# EAGLE design SSRBoard (EAGLE 6.3)
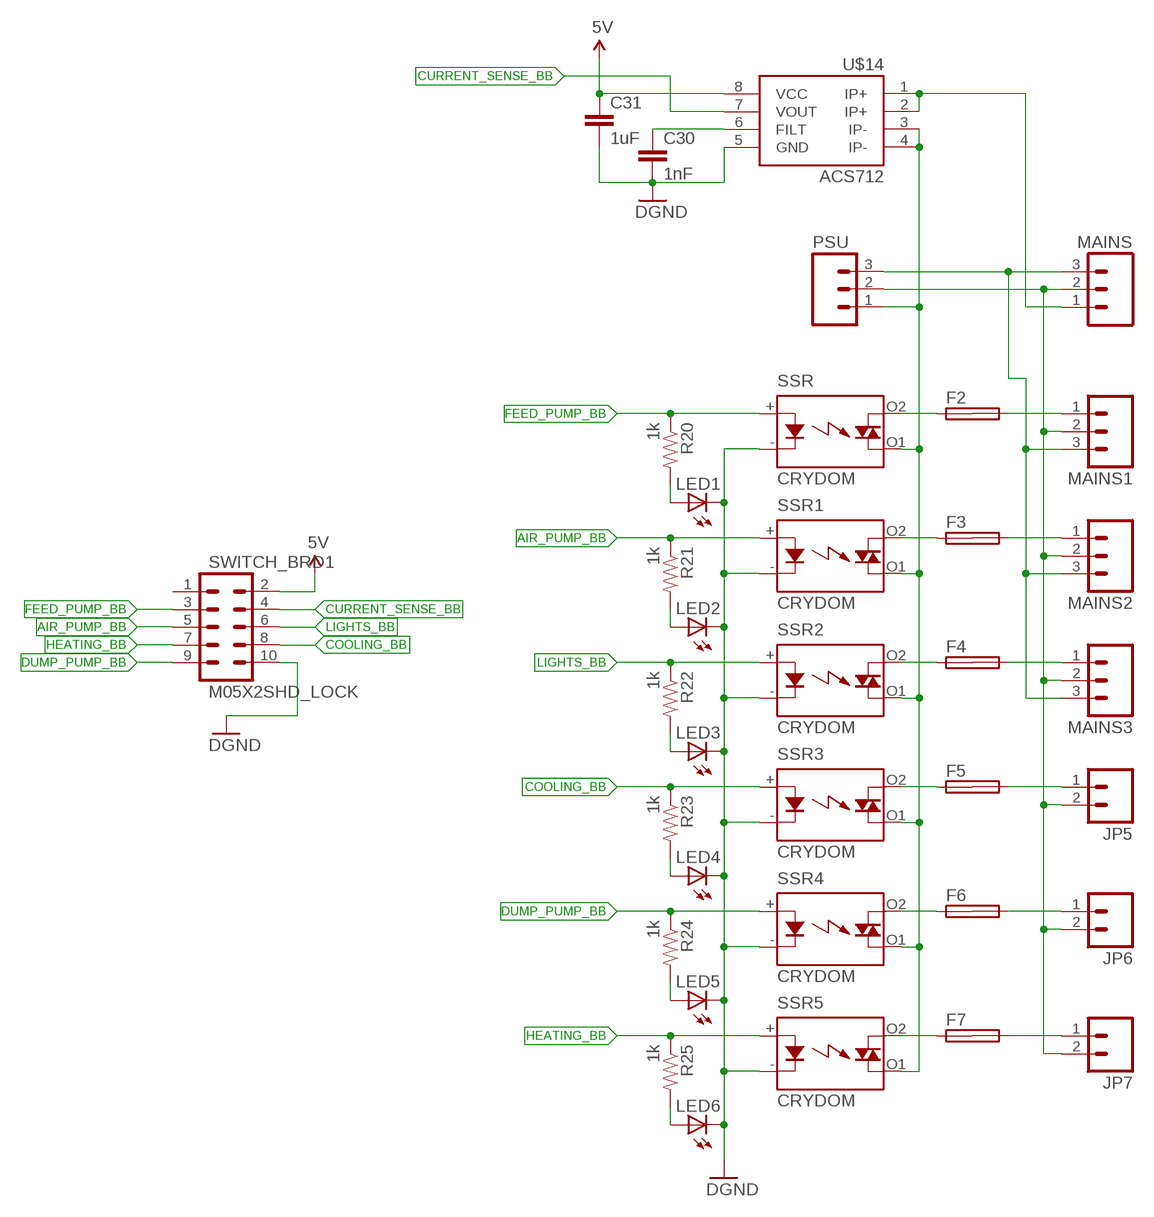
[diagram p0: schematic, sheet 1]

## Parts
C30  1nF  CAP0805  [0805]
C31  1uF  CAP0805  [0805]
F2  SHK20L  [SHK20L]
F3  SHK20L  [SHK20L]
F4  SHK20L  [SHK20L]
F5  SHK20L  [SHK20L]
F6  SHK20L  [SHK20L]
F7  SHK20L  [SHK20L]
JP5  M025MM  [SCREWTERMINAL-5MM-2]
JP6  M025MM  [SCREWTERMINAL-5MM-2]
JP7  M025MM  [SCREWTERMINAL-5MM-2]
LED1  LEDSML0805  [SML0805]
LED2  LEDSML0805  [SML0805]
LED3  LEDSML0805  [SML0805]
LED4  LEDSML0805  [SML0805]
LED5  LEDSML0805  [SML0805]
LED6  LEDSML0805  [SML0805]
MAINS  M03-SCREW-5MM  [SCREWTERMINAL-5MM-3]
MAINS1  M03-SCREW-5MM  [SCREWTERMINAL-5MM-3]
MAINS2  M03-SCREW-5MM  [SCREWTERMINAL-5MM-3]
MAINS3  M03-SCREW-5MM  [SCREWTERMINAL-5MM-3]
PSU  M03-SCREW-5MM  [SCREWTERMINAL-5MM-3]
R20  1k  RESISTOR0805-RES  [0805]
R21  1k  RESISTOR0805-RES  [0805]
R22  1k  RESISTOR0805-RES  [0805]
R23  1k  RESISTOR0805-RES  [0805]
R24  1k  RESISTOR0805-RES  [0805]
R25  1k  RESISTOR0805-RES  [0805]
SSR  CRYDOM  AQG22224  [AQG]
SSR1  CRYDOM  AQG22224  [AQG]
SSR2  CRYDOM  AQG22224  [AQG]
SSR3  CRYDOM  AQG22224  [AQG]
SSR4  CRYDOM  AQG22224  [AQG]
SSR5  CRYDOM  AQG22224  [AQG]
SWITCH_BRD1  M05X2SHD_LOCK  [2X5-SHROUDED_LOCK]
U$14  ACS712  [SO08]

## Nets
5V_BB: C31.1 SWITCH_BRD1.2 U$14.8(VCC) ; supply symbol labelled 5V
AIR_PUMP_BB: R21.1 SSR1.+(A) SWITCH_BRD1.5
COOLING_BB: R23.1 SSR3.+(A) SWITCH_BRD1.8
CURRENT_SENSE_BB: SWITCH_BRD1.4 U$14.7(VOUT)
DUMP_PUMP_BB: R24.1 SSR4.+(A) SWITCH_BRD1.9
FEED_PUMP_BB: R20.1 SSR.+(A) SWITCH_BRD1.3
GND_BB: C30.2 C31.2 LED1.C LED2.C LED3.C LED4.C LED5.C LED6.C SSR1.-(K) SSR2.-(K) SSR3.-(K) SSR4.-(K) SSR5.-(K) SSR.-(K) SWITCH_BRD1.10 U$14.5(GND) ; supply symbol labelled DGND
HEATING_BB: R25.1 SSR5.+(A) SWITCH_BRD1.7
LIGHTS_BB: R22.1 SSR2.+(A) SWITCH_BRD1.6
MAIN_ACTIVE: PSU.1 SSR1.O1(DS2) SSR2.O1(DS2) SSR3.O1(DS2) SSR4.O1(DS2) SSR5.O1(DS2) SSR.O1(DS2) U$14.3(IP-) U$14.4(IP-)
MAIN_ACTIVE1: MAINS.1 U$14.1(IP+) U$14.2(IP+)
MAIN_EARTH: MAINS1.3 MAINS2.3 MAINS3.3 MAINS.3 PSU.3
MAIN_NETURAL: JP5.2 JP6.2 JP7.2 MAINS1.2 MAINS2.2 MAINS3.2 MAINS.2 PSU.2
N$37: F3.1A SSR1.O2(DS1)
N$38: F2.1A SSR.O2(DS1)
N$39: F4.1A SSR2.O2(DS1)
N$40: F5.1A SSR3.O2(DS1)
N$41: F6.1A SSR4.O2(DS1)
N$42: F7.1A SSR5.O2(DS1)
N$43: LED1.A R20.2
N$44: F2.2A MAINS1.1
N$45: F3.2A MAINS2.1
N$46: F4.2A MAINS3.1
N$47: F5.2A JP5.1
N$48: F6.2A JP6.1
N$49: F7.2A JP7.1
N$50: LED2.A R21.2
N$51: LED3.A R22.2
N$52: LED4.A R23.2
N$53: C30.1 U$14.6(FILT)
N$59: LED5.A R24.2
N$60: LED6.A R25.2
Unconnected: F2.1B F2.2B F3.1B F3.2B F4.1B F4.2B F5.1B F5.2B F6.1B F6.2B F7.1B F7.2B SWITCH_BRD1.1

## Library data of the parts
C30 C31 = SparkFun-Capacitors:CAP: Capacitor Standard 0603 ceramic capacitor, and 0.1" leaded capacitor.
F2-F7 = fuse:SHK20L: FUSE HOLDER 5 x 20 mm, SH contact, SHH1 Schukat, E1073 Buerklin; OC_FARNELL: unknown; OC_NEWARK: unknown
JP5-JP7 = SparkFun-Connectors:M02: Header 2 Standard 2-pin 0.1" header. Use with straight break away headers (SKU : PRT-00116), right angle break away headers (PRT-00553), swiss pins (PRT-00743), machine pins (PRT-00117), and female headers (PRT-00115). Molex polarized connector foot print use with SKU : PRT-08233 with associated crimp pins and housings.
LED1-LED6 = led:LED: LED OSRAM: - CHIPLED LG R971, LG N971, LY N971, LG Q971, LY Q971, LO R971, LY R971 LH N974, LH R974 LS Q976, LO Q976, LY Q976 LO Q996 - Hyper CHIPLED LW Q18S LB Q993, LB Q99A, LB R99A - SideLED LS A670, LO A670, LY A670, LG A670, LP A670 LB A673, LV A673, LT A673, LW A673 LH A674 LY A675 LS A676, LA A676, LO A676, LY A676, LW A676 LS A679, LY A679, LG A679 - Hyper Micro SIDELED® LS Y876, LA Y876, LO Y876, LY Y876 LT Y87S - SmartLED LW L88C, LW L88S LB L89C, LB L89S, LG L890 LS L89K, LO L89K, LY L89K LS L896, LA L896, LO L896, LY L896 - TOPLED LS T670, LO T670, LY T670, LG T670, LP T670 LSG T670, LSP T670, LSY T670, LOP T670, LYG T670 LG T671, LOG T671, LSG T671 LB T673, LV T673, LT T673, LW T673 LH T674 LS T676, LA T676, LO T676, LY T676, LB T676, LH T676, LSB T676, LW T676 LB T67C, LV T67C, LT T67C, LS T67K, LO T67K, LY T67K, LW E67C LS E67B, LA E67B, LO E67B, LY E67B, LB E67C, LV E67C, LT E67C LW T67C LS T679, LY T679, LG T679 LS T770, LO T770, LY T770, LG T770, LP T770 LB T773, LV T773, LT T773, LW T773 LH T774 LS E675, LA E675, LY E675, LS T675 LS T776, LA T776, LO T776, LY T776, LB T776 LHGB T686 LT T68C, LB T68C - Hyper Mini TOPLED® LB M676 - Mini TOPLED Santana® LG M470 LS M47K, LO M47K, LY M47K Source: http://www.osram.convergy.de LUXEON: - LUMILED® LXK2-PW12-R00, LXK2-PW12-S00, LXK2-PW14-U00, LXK2-PW14-V00 LXK2-PM12-R00, LXK2-PM12-S00, LXK2-PM14-U00 LXK2-PE12-Q00, LXK2-PE12-R00, LXK2-PE12-S00, LXK2-PE14-T00, LXK2-PE14-U00 LXK2-PB12-K00, LXK2-PB12-L00, LXK2-PB12-M00, LXK2-PB14-N00, LXK2-PB14-P00, LXK2-PB14-Q00 LXK2-PR12-L00, LXK2-PR12-M00, LXK2-PR14-Q00, LXK2-PR14-R00 LXK2-PD12-Q00, LXK2-PD12-R00, LXK2-PD12-S00 LXK2-PH12-R00, LXK2-PH12-S00 LXK2-PL12-P00, LXK2-PL12-Q00, LXK2-PL12-R00 Source: www.luxeon.com KINGBRIGHT: KA-3528ASYC Source: www.kingbright.com
MAINS MAINS1-MAINS3 PSU = SparkFun-Connectors:M03: Header 3 Standard 3-pin 0.1" header. Use with straight break away headers (SKU : PRT-00116), right angle break away headers (PRT-00553), swiss pins (PRT-00743), machine pins (PRT-00117), and female headers (PRT-00115). Molex polarized connector foot print use with SKU : PRT-08232 with associated crimp pins and housings.
R20-R25 = SparkFun-Resistors:RESISTOR: Resistor Basic schematic elements and footprints for 0603, 1206, and PTH resistors.
SSR SSR1-SSR5 = 1_Skips:AQG*: SOLID STATE RELAY NAiS Zero-cross, Non zero-cross Source: http://www.mew-europe.com/.. en_ds_61611_0000.pdf; MPN: AQG22224; OC_FARNELL: unknown; OC_NEWARK: 11N2589
SWITCH_BRD1 = SparkFun-Connectors:M05X2: Header 5x2 Standard 10-pin dual row 0.1" header. Commonly used with AVR-ISP. Use with Spark Fun Electronics SKU: PRT-00778
U$14 = SparkFun-AnalogIC:ACS712: Hall-effect-based isolated linear current sensor

## Board
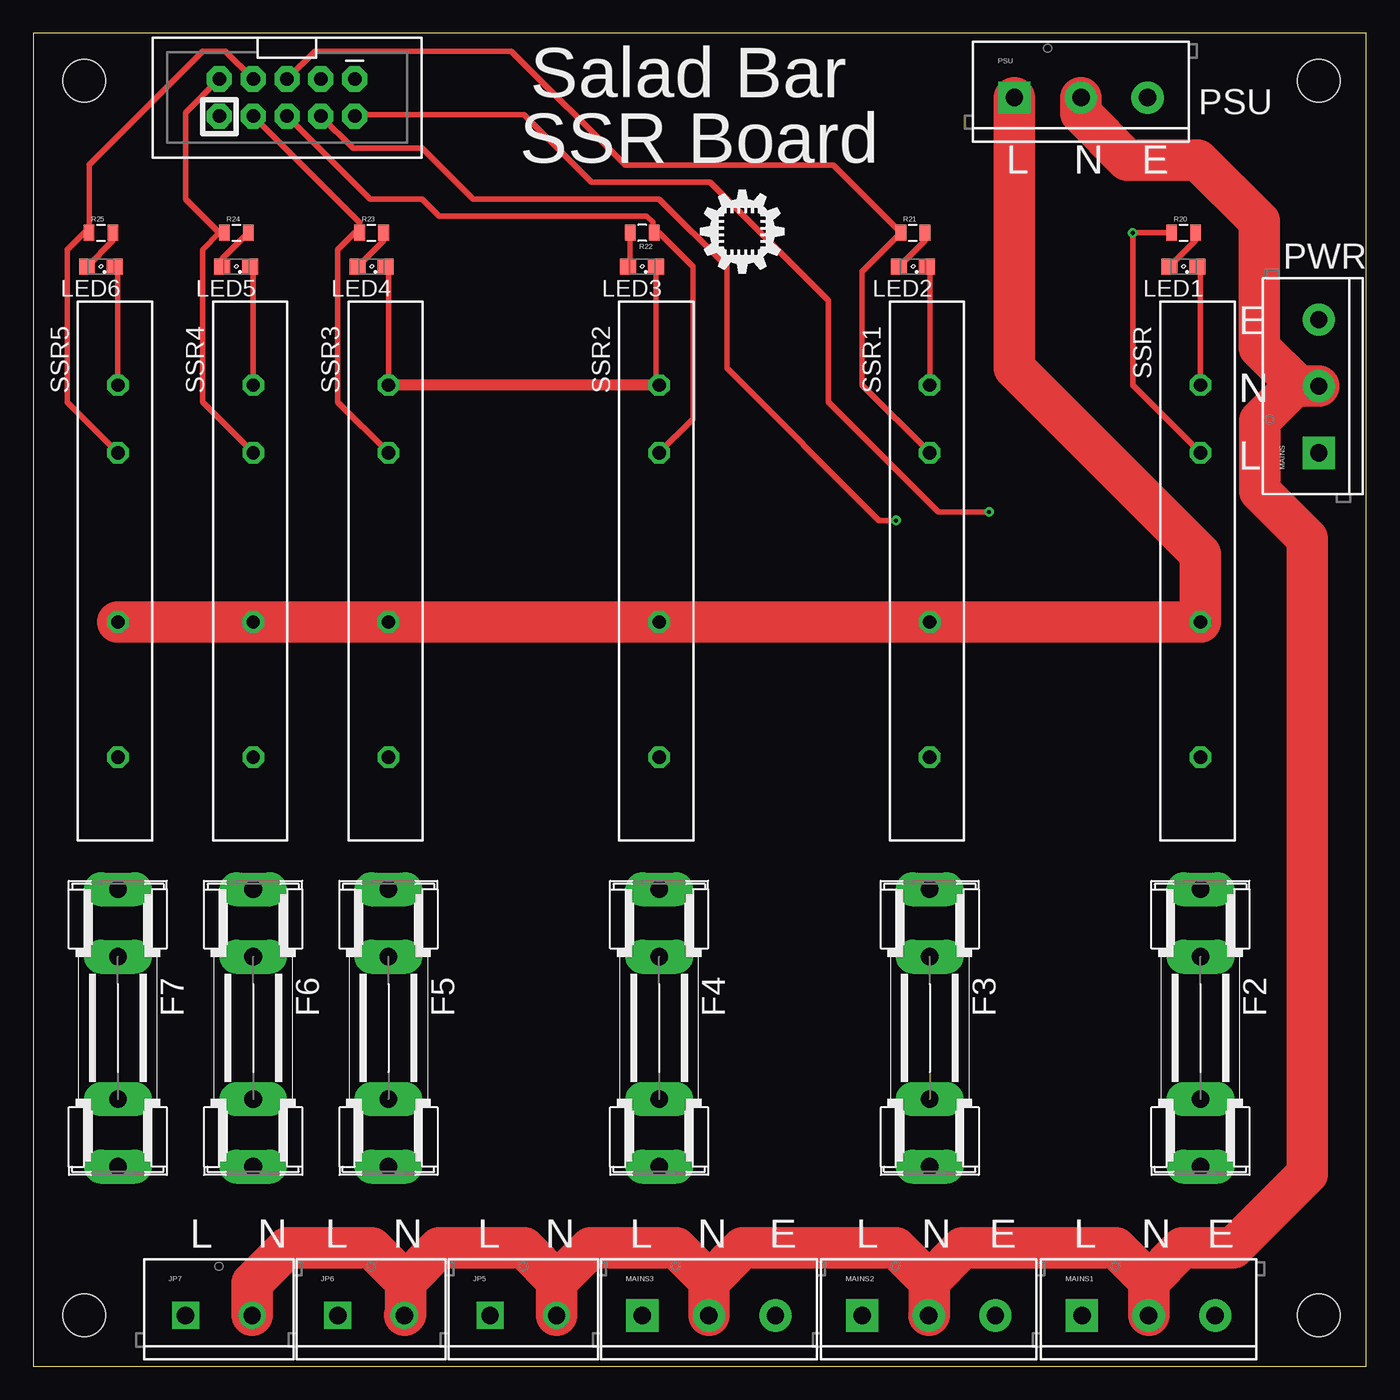
[diagram p1: board, top side]
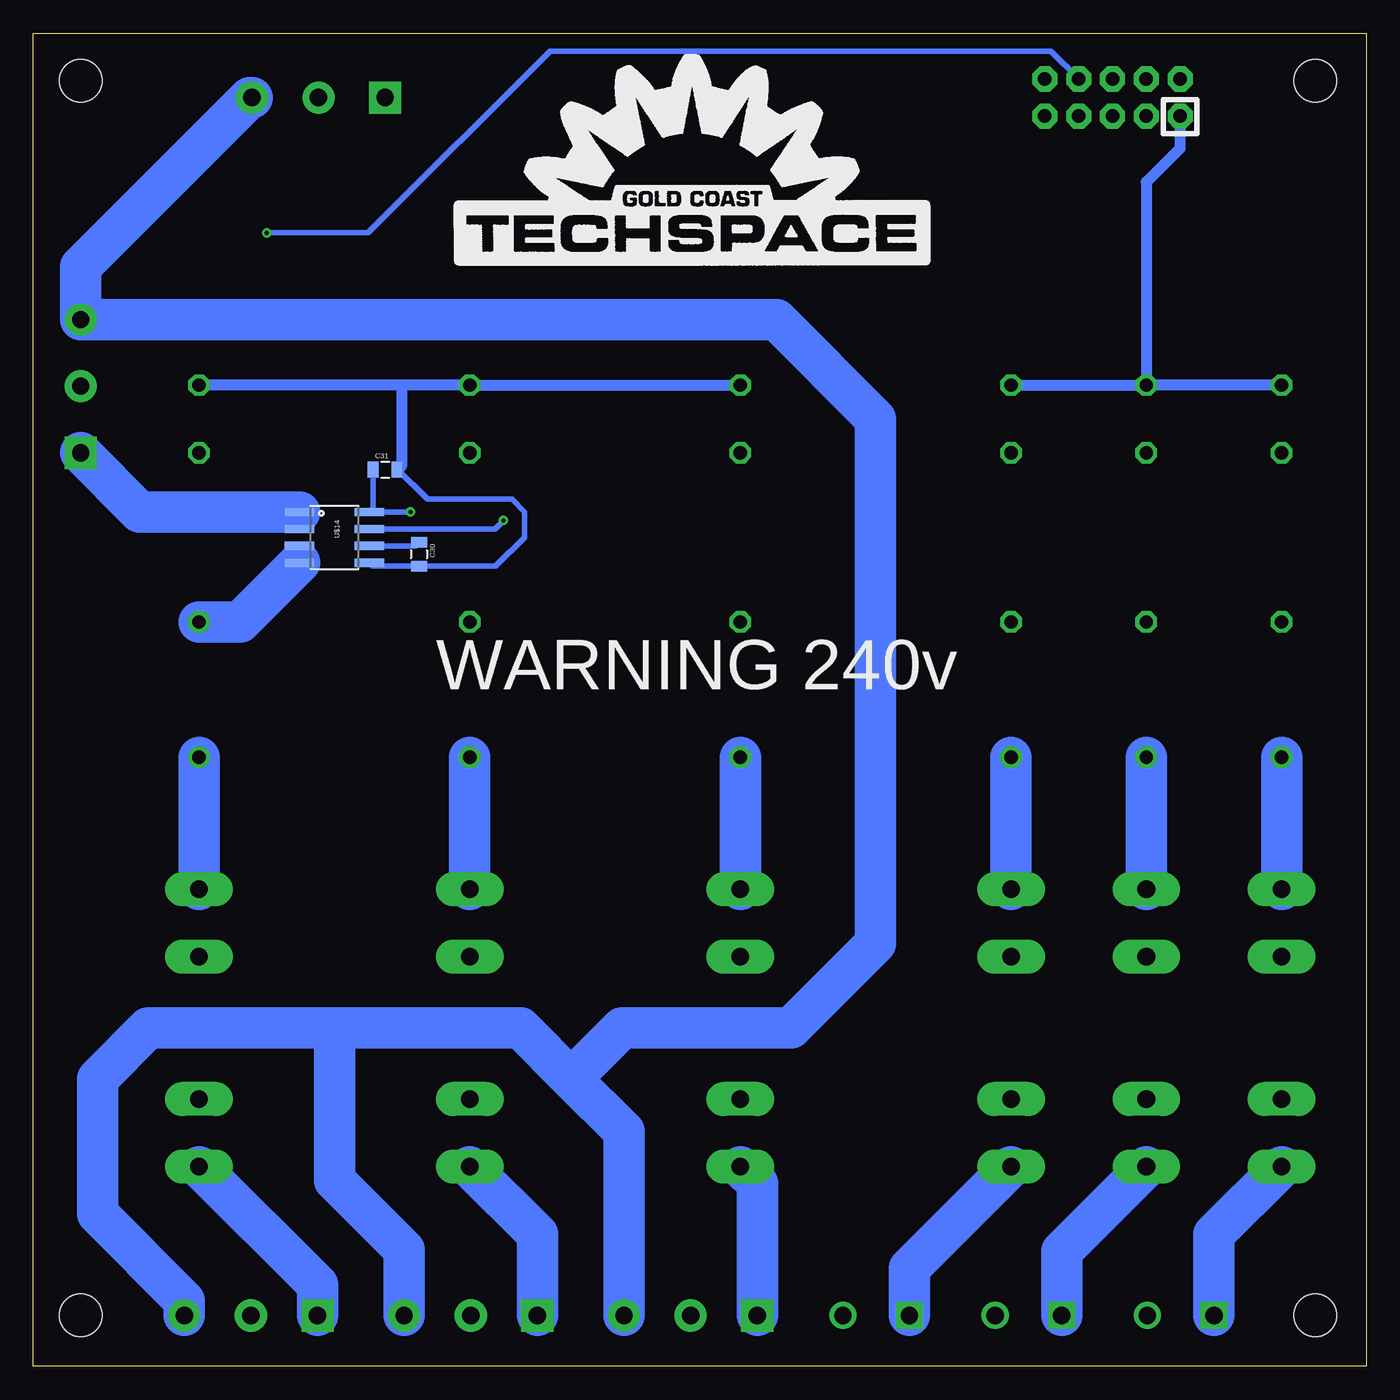
[diagram p2: board, bottom side, seen from below]

Size 100.08 x 100.08 mm. Coordinates in mm from the lower left corner, seen from the top.
Outline: 0,0 100.08,0 100.08,100.08 0,100.08 0,0
Copper layers (1*16): Top 0.035mm / dielectric 1.5mm / Bottom 0.035mm
Design rules "DFRobot_Eagle_Rule_v0.4": minimum track width 6mil, minimum drill 12mil, track to track 6mil, track to pad 6mil, pad to pad 6mil, via to via 6mil, smd to smd 0mil, copper to edge 10mil, drill to drill 10mil, minimum pad ring 12mil, minimum via ring 8mil, stop-mask expansion 2mil, vias tented up to drill 25mil, thermal gap 10mil
Holes 3.2 mm at 3.81,96.52 96.52,96.52 96.52,3.81 3.81,3.81

### Footprints (pad centres in the part's own frame; a part is rotated, then mirrored left to right if it is on the bottom)
0805 = smd 0.8 x 1.2: 1 -0.9,0; 2 0.9,0
SHK20L = drill 1.321 pad 2.54 long: 1A -10.414,0; 1B -5.334,0; 2A 10.414,0; 2B 5.334,0
SCREWTERMINAL-5MM-2 = drill 1.3 pad 2.032 square: 1 0,0 | drill 1.3 pad 2.032: 2 5,0
SML0805 = smd 1.2 x 1.2: A 1.05,0; C -1.05,0
SCREWTERMINAL-5MM-3 = drill 1.3 pad 2.413 square: 1 0,0 | drill 1.3 pad 2.413: 2 5,0; 3 10,0
AQG = drill 1 octagon: + 5.08,0; - 0,0; O1 17.78,0; O2 27.94,0
2X5-SHROUDED_LOCK = drill 1.016 pad 1.88 octagon: 1 -1.397,5.08; 2 1.397,5.08; 3 -1.397,2.54; 4 1.397,2.54; 5 -1.397,0; 6 1.397,0; 7 -1.397,-2.54; 8 1.397,-2.54; 9 -1.397,-5.08; 10 1.397,-5.08
SO08 = smd 0.61 x 2.21: 1 -1.905,-2.616; 2 -0.635,-2.616; 3 0.635,-2.616; 4 1.905,-2.616; 5 1.905,2.616; 6 0.635,2.616; 7 -0.635,2.616; 8 -1.905,2.616

### Placement (x,y rotation side)
C30  71.12,60.96 270 bottom
C31  73.66,67.31 0 bottom
F2  87.63,25.4 270 top
F3  67.31,25.4 270 top
F4  46.99,25.4 270 top
F5  26.67,25.4 270 top
F6  16.51,25.4 270 top
F7  6.35,25.4 270 top
JP5  34.29,3.81 0 top
JP6  22.86,3.81 0 top
JP7  11.43,3.81 0 top
LED1  86.36,82.55 180 top
LED2  66.04,82.55 180 top
LED3  45.72,82.55 180 top
LED4  25.4,82.55 180 top
LED5  15.24,82.55 180 top
LED6  5.08,82.55 180 top
MAINS  96.52,68.58 90 top
MAINS1  78.74,3.81 0 top
MAINS2  62.23,3.81 0 top
MAINS3  45.72,3.81 0 top
PSU  73.66,95.25 0 top
R20  86.36,85.09 0 top
R21  66.04,85.09 0 top
R22  45.72,85.09 180 top
R23  25.4,85.09 0 top
R24  15.24,85.09 0 top
R25  5.08,85.09 0 top
SSR  87.63,73.66 270 top
SSR1  67.31,73.66 270 top
SSR2  46.99,73.66 270 top
SSR3  26.67,73.66 270 top
SSR4  16.51,73.66 270 top
SSR5  6.35,73.66 270 top
SWITCH_BRD1  19.05,95.25 270 top
U$14  77.47,62.23 270 bottom
U$21  [GCTS_X0.75]  68.58,82.55 0 bottom
U$24  [ID_LOGO_X0.25]  50.01,81.92 0 top

### Tracks (layer width: path | path; a pad name or v marks a point on that pad's centre or on a via)
5V_BB  (via drill 0.3)
  Top 0.406: SWITCH_BRD1.2 24.26,93.98 36.83,93.98 41.91,88.9 50.8,88.9 59.69,80.01 59.69,72.39 67.94,64.14 v71.75,64.14
  Bottom 0.406: C31.1 74.56,64.43 U$14.8 v71.75,64.14
AIR_PUMP_BB
  Top 0.406: SWITCH_BRD1.5 21.14,98.74 35.88,98.74 44.45,90.17 60.06,90.17 R21.1 62.23,82.18 62.23,73.66 SSR1.+
COOLING_BB
  Top 0.406: SSR3.+ 22.86,72.39 22.86,83.82 24.13,85.09 R23.1 24.5,85.86 SWITCH_BRD1.8
CURRENT_SENSE_BB  (via drill 0.3)
  Top 0.406: v64.77,63.5 63.5,63.5 52.07,74.93 52.07,82.55 46.99,87.63 33.02,87.63 29.21,91.44 24,91.44 SWITCH_BRD1.4
  Bottom 0.406: U$14.7 65.41,62.87 v64.77,63.5
DUMP_PUMP_BB
  Top 0.406: 13.97,85.09 12.7,83.82 12.7,72.39 SSR4.+ | SWITCH_BRD1.9 11.43,94.11 11.43,87.63 13.97,85.09 | 13.97,85.09 R24.1
FEED_PUMP_BB  (via drill 0.3)
  Top 0.406: R20.1 v82.55,85.09 82.55,73.66 SSR.+
  Bottom 0.406: SWITCH_BRD1.3 23.69,98.74 61.28,98.74 74.93,85.09 v82.55,85.09
GND_BB
  Top 0.406: LED1.C 87.63,82.33 SSR.- | SSR1.- 67.31,82.33 LED2.C 67.31,82.55 | 46.99,82.33 LED3.C 46.77,73.88 SSR2.- | LED4.C 26.67,82.33 SSR3.- | LED5.C 16.51,82.33 SSR4.- | LED6.C 6.35,82.33 SSR5.-
  Top 0.813: SSR2.- SSR3.-
  Bottom 0.406: U$14.5 74.59,60.06 C30.2 65.35,60.06 63.18,62.23 63.18,64.14 64.14,65.09 70.48,65.09 72.71,67.31 C31.2
  Bottom 0.813: SSR4.- 16.51,88.9 13.97,91.44 SWITCH_BRD1.10 | SSR5.- SSR4.- | SSR3.- SSR4.- | SSR2.- SSR1.- 72.39,73.66 | 72.39,73.66 SSR.- | 72.71,67.31 72.39,67.63 72.39,73.66
HEATING_BB
  Top 0.406: SSR5.+ 2.54,72.39 2.54,83.82 3.81,85.09 R25.1 4.18,90.22 12.7,98.74 14.41,98.74 SWITCH_BRD1.7
LIGHTS_BB
  Top 0.406: SWITCH_BRD1.6 25.27,87.63 29.21,87.63 30.48,86.36 46.04,86.36 46.51,85.88 46.51,85.2 R22.1 46.99,85.09 49.53,82.55 49.53,71.12 SSR2.+
MAIN_ACTIVE
  Top 3.1: SSR5.O1 SSR4.O1 SSR3.O1 SSR2.O1 SSR1.O1 SSR.O1 87.63,60.96 73.66,74.93 PSU.1
  Bottom 0.406: U$14.3 U$14.4
  Bottom 3.1: U$14.4 84.53,55.88 SSR.O1
MAIN_ACTIVE1
  Bottom 0.406: U$14.2 U$14.1
  Bottom 3.1: MAINS.1 92.08,64.14 U$14.1
MAIN_EARTH
  Bottom 3.1: PSU.3 83.82,95.25 96.52,82.55 MAINS.3 44.29,78.58 36.83,71.12 36.83,31.75 43.18,25.4 55.88,25.4 59.69,21.59 | MAINS3.3 55.72,17.62 59.69,21.59 | 59.69,21.59 63.5,25.4 77.47,25.4 | MAINS2.3 72.23,8.73 77.47,13.97 77.47,25.4 | MAINS1.3 88.74,4.92 95.25,11.43 95.25,21.59 91.44,25.4 77.47,25.4
MAIN_NETURAL
  Top 3.1: MAINS.2 94.96,73.58 | 94.96,73.58 92.06,76.48 92.06,85.96 87.45,90.56 82.16,90.56 78.66,94.06 PSU.2 | JP7.2 16.43,6.27 19.05,8.89 25.4,8.89 27.94,6.35 | 27.94,6.35 27.94,3.89 JP6.2 | JP5.2 39.29,6.35 | 39.29,6.35 39.29,6.43 36.83,8.89 30.48,8.89 27.94,6.35 | 50.72,6.35 50.72,6.43 48.26,8.89 41.83,8.89 39.29,6.35 | 67.27,6.39 69.77,8.89 81.28,8.89 83.74,6.43 83.74,6.35 | 67.27,6.39 67.23,6.35 67.23,6.43 64.77,8.89 53.26,8.89 50.72,6.35 | 94.96,73.58 94.67,73.58 92.09,71 92.09,65.72 95.65,62.16 95.65,14.45 90.09,8.89 86.28,8.89 83.74,6.35 | 50.72,6.35 MAINS3.2 | 83.74,5 MAINS1.2 83.74,6.35 | MAINS2.2 67.27,3.85 67.27,6.39
N$37
  Bottom 3.1: SSR1.O2 F3.1A
N$38
  Bottom 3.1: SSR.O2 F2.1A
N$39
  Bottom 3.1: SSR2.O2 F4.1A
N$40
  Bottom 3.1: SSR3.O2 F5.1A
N$41
  Bottom 3.1: SSR4.O2 F6.1A
N$42
  Bottom 3.1: SSR5.O2 F7.1A
N$43
  Top 0.406: LED1.A 87.26,84.5 R20.2
N$44
  Bottom 3.1: F2.2A 78.74,6.1 MAINS1.1
N$45
  Bottom 3.1: F3.2A 62.23,9.91 MAINS2.1
N$46
  Bottom 3.1: F4.2A 45.72,13.72 MAINS3.1
N$47
  Bottom 3.1: F5.2A 34.29,7.37 JP5.1
N$48
  Bottom 3.1: F6.2A 22.86,8.64 JP6.1
N$49
  Bottom 3.1: F7.2A 11.43,9.91 JP7.1
N$50
  Top 0.406: LED2.A 66.94,84.5 R21.2
N$51
  Top 0.406: R22.2 44.82,82.7 LED3.A
N$52
  Top 0.406: LED4.A 26.3,84.5 R23.2
N$53
  Bottom 0.406: U$14.6 71.39,61.59 C30.1
N$59
  Top 0.406: LED5.A 14.19,83.14 R24.2
N$60
  Top 0.406: LED6.A 5.98,84.5 R25.2

### Text on the board
tPlace: Salad Bar | PSU | SSR Board | L | N | E | PWR | E | N | N | L | L | N | L | N | L | N | L | N | E | L | N | E | L | N | E
bPlace: WARNING 240v